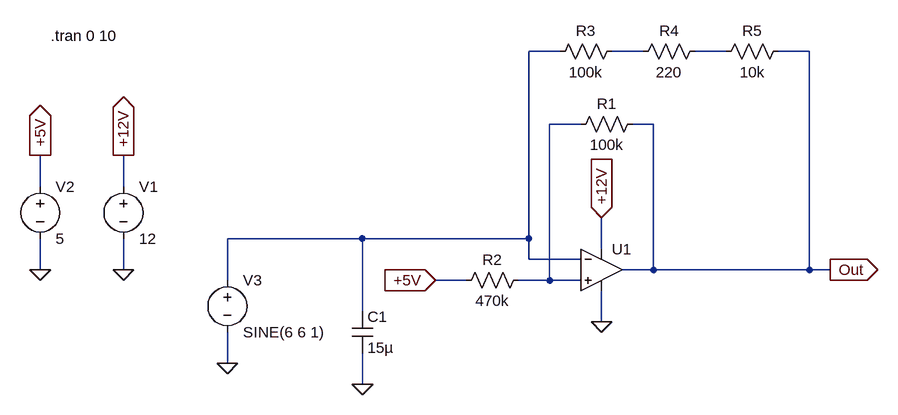
[diagram p0: schematic LFO.asc]
LFO.asc, the LTspice schematic file:
Version 4.1
SHEET 1 880 680
WIRE 128 -160 80 -160
WIRE 256 -160 208 -160
WIRE 384 -160 336 -160
WIRE 512 -160 464 -160
WIRE 160 -48 112 -48
WIRE 272 -48 240 -48
WIRE -672 48 -672 0
WIRE -544 48 -544 0
WIRE -176 128 -384 128
WIRE 80 128 80 -160
WIRE 80 128 -176 128
WIRE 192 144 192 96
WIRE 80 160 80 128
WIRE 160 160 80 160
WIRE -672 176 -672 128
WIRE -544 176 -544 128
WIRE 272 176 272 -48
WIRE 272 176 224 176
WIRE 512 176 512 -160
WIRE 512 176 272 176
WIRE 544 176 512 176
WIRE -384 192 -384 128
WIRE -16 192 -64 192
WIRE 112 192 112 -48
WIRE 112 192 64 192
WIRE 160 192 112 192
WIRE -176 240 -176 128
WIRE 192 256 192 208
WIRE -384 320 -384 272
WIRE -176 352 -176 304
FLAG -544 176 0
FLAG 192 256 0
FLAG 192 96 +12V
IOPIN 192 96 In
FLAG -544 0 +12V
IOPIN -544 0 Out
FLAG -176 352 0
FLAG -672 176 0
FLAG -672 0 +5V
IOPIN -672 0 Out
FLAG -64 192 +5V
IOPIN -64 192 In
FLAG 544 176 Out
IOPIN 544 176 Out
FLAG -384 320 0
SYMBOL OpAmps\\UniversalOpAmp2 192 176 R0
SYMATTR InstName U1
SYMBOL voltage -544 32 R0
SYMATTR InstName V1
SYMATTR Value 12
SYMBOL cap -192 240 R0
SYMATTR InstName C1
SYMATTR Value 15µ
SYMBOL res 256 -64 R90
WINDOW 0 0 56 VBottom 2
WINDOW 3 32 56 VTop 2
SYMATTR InstName R1
SYMATTR Value 100k
SYMBOL res 80 176 R90
WINDOW 0 0 56 VBottom 2
WINDOW 3 32 56 VTop 2
SYMATTR InstName R2
SYMATTR Value 470k
SYMBOL voltage -672 32 R0
SYMATTR InstName V2
SYMATTR Value 5
SYMBOL res 224 -176 R90
WINDOW 0 0 56 VBottom 2
WINDOW 3 32 56 VTop 2
SYMATTR InstName R3
SYMATTR Value 100k
SYMBOL res 352 -176 R90
WINDOW 0 0 56 VBottom 2
WINDOW 3 32 56 VTop 2
SYMATTR InstName R4
SYMATTR Value 220
SYMBOL res 480 -176 R90
WINDOW 0 0 56 VBottom 2
WINDOW 3 32 56 VTop 2
SYMATTR InstName R5
SYMATTR Value 10k
SYMBOL voltage -384 176 R0
SYMATTR InstName V3
SYMATTR Value SINE(6 6 1)
TEXT -656 -184 Left 2 !.tran 0 10

The netlist it stands for:
* LFO.asc
X§U1 N004 N001 +12V 0 Out level2 Avol=1Meg GBW=10Meg Slew=10Meg Ilimit=25m Rail=0 Vos=0 En=0 Enk=0 In=0 Ink=0 Rin=500Meg  ; pins In+ In- V+ V- OUT
V1 +12V 0 12
C1 N001 0 15µ
R1 Out N004 100k
R2 N004 +5V 470k
V2 +5V 0 5
R3 N002 N001 100k
R4 N003 N002 220
R5 Out N003 10k
V3 N001 0 SINE(6 6 1)
.tran 0 10
.lib UniversalOpAmp2.lib
.backanno
.end